# Altium schematic sheet IMX8_SOC.SchDoc
size 594 x 420 mm; SheetNumber: 3; SheetTotal: 12
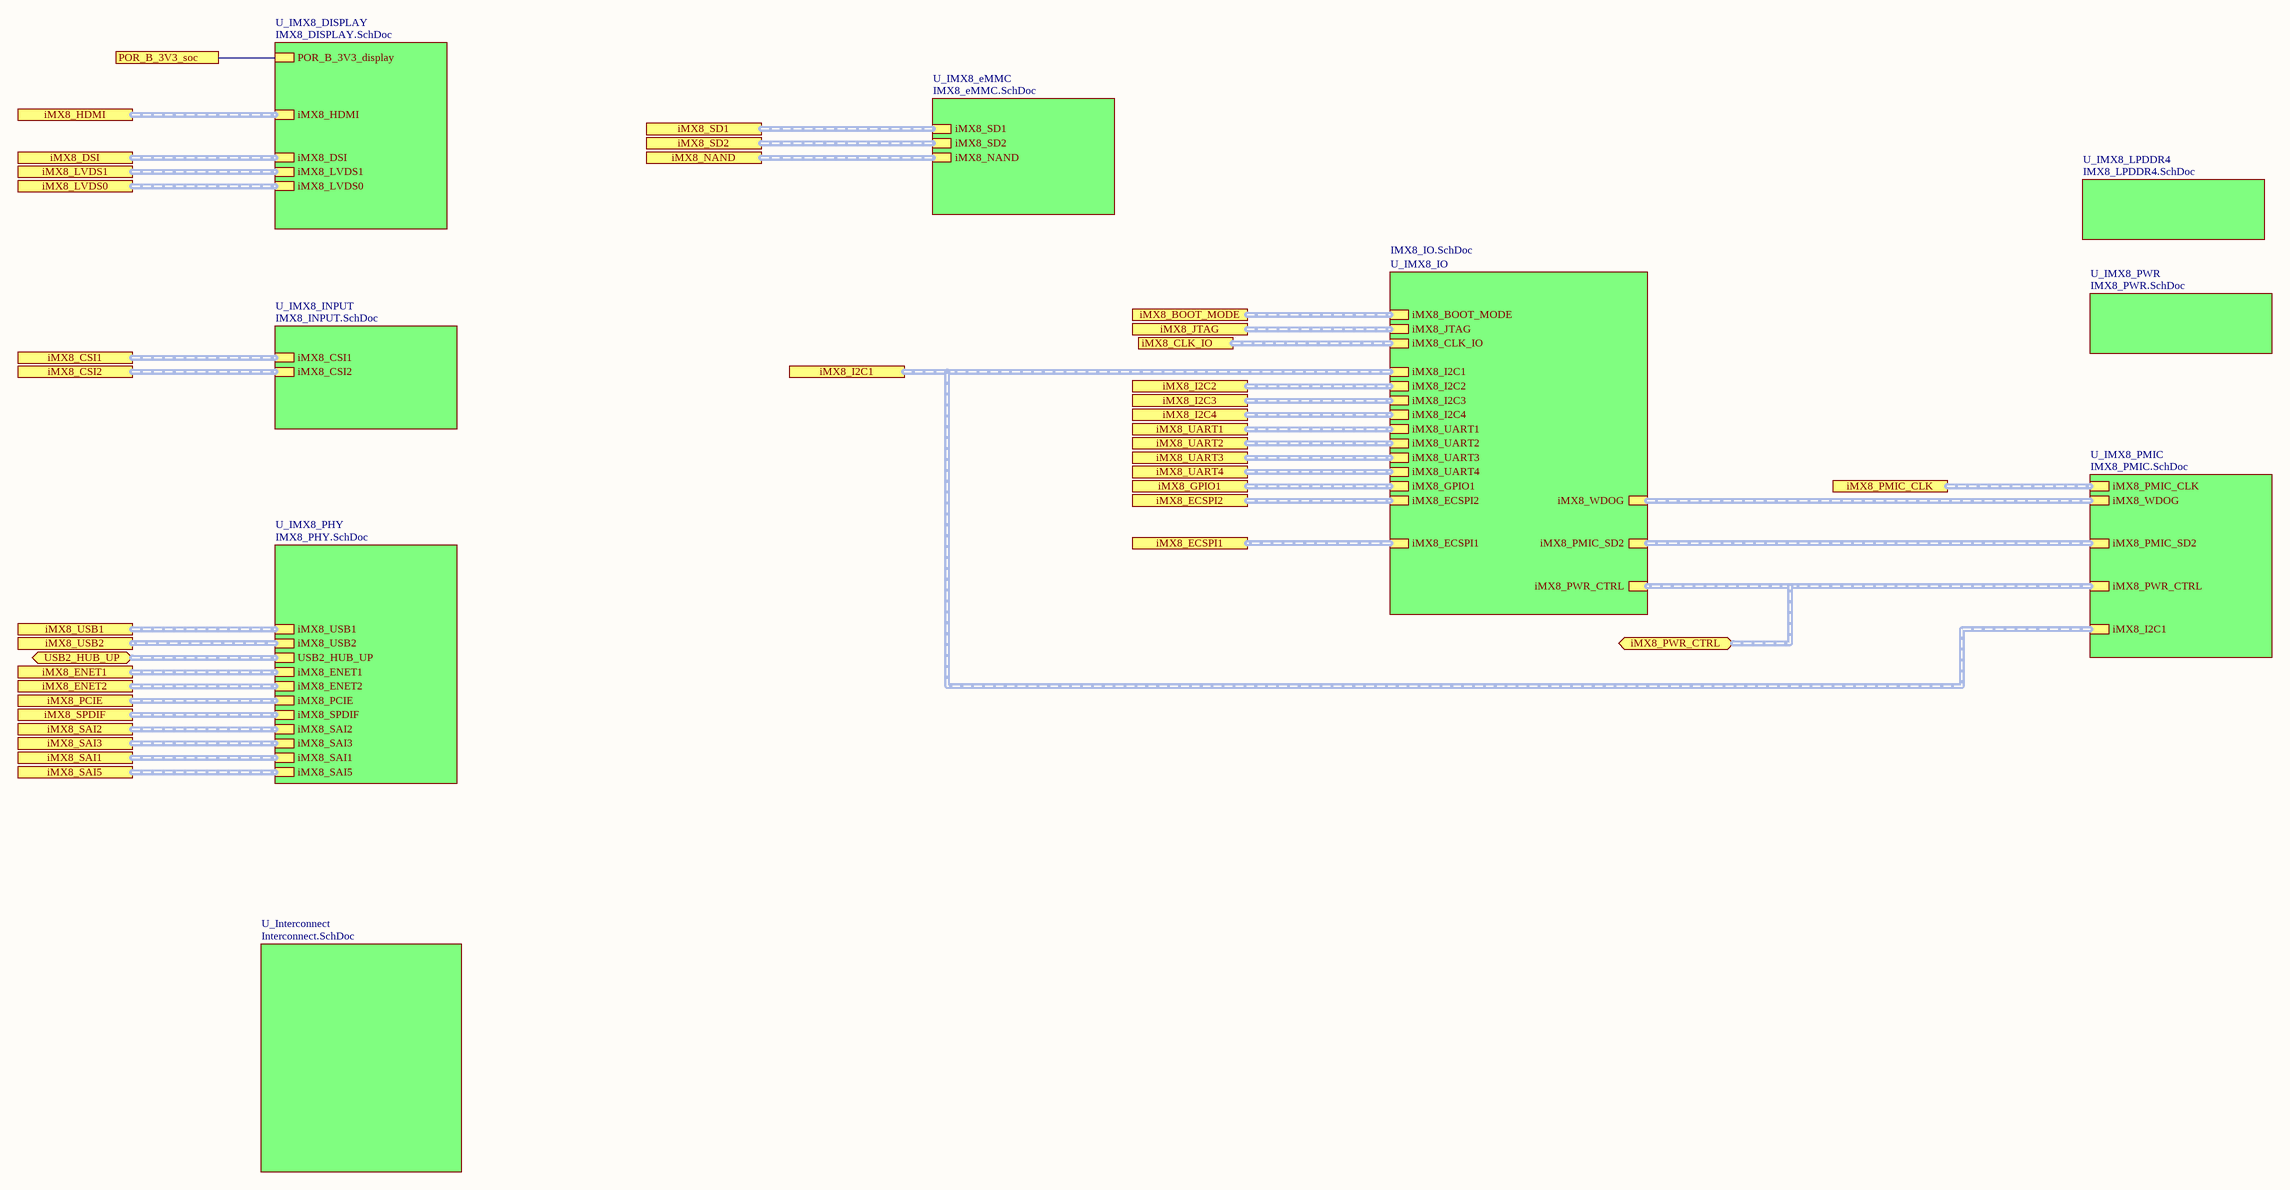
[diagram p0: IMX8_SOC.SchDoc]

## Sub-sheets
U_IMX8_DISPLAY = IMX8_DISPLAY.SchDoc: iMX8_LVDS0 (harness iMX8_LVDS0), iMX8_LVDS1 (harness iMX8_LVDS1), iMX8_DSI (harness iMX8_DSI), iMX8_HDMI (harness iMX8_HDMI), POR_B_3V3_display
U_IMX8_eMMC = IMX8_eMMC.SchDoc: iMX8_SD1 (harness iMX8_SD1), iMX8_SD2 (harness iMX8_SD2), iMX8_NAND (harness iMX8_NAND)
U_IMX8_INPUT = IMX8_INPUT.SchDoc: iMX8_CSI1 (harness iMX8_CSI1), iMX8_CSI2 (harness iMX8_CSI2)
U_IMX8_IO = IMX8_IO.SchDoc: iMX8_BOOT_MODE (harness iMX8_BOOT_MODE), iMX8_JTAG (harness iMX8_JTAG), iMX8_CLK_IO (harness iMX8_CLK_IO_sub), iMX8_PWR_CTRL (harness iMX8_PWR_CTRL), iMX8_I2C1 (harness iMX8_I2C1), iMX8_I2C2 (harness iMX8_I2C2), iMX8_I2C3 (harness iMX8_I2C3), iMX8_I2C4 (harness iMX8_I2C4), iMX8_UART1 (harness iMX8_UART1), iMX8_UART2 (harness iMX8_UART2), iMX8_UART3 (harness iMX8_UART3), iMX8_UART4 (harness iMX8_UART4), iMX8_GPIO1 (harness iMX8_GPIO1), iMX8_ECSPI2 (harness iMX8_ECSPI2), iMX8_WDOG (harness iMX8_WDOG), iMX8_PMIC_SD2 (harness iMX8_PMIC_SD2), iMX8_ECSPI1 (harness iMX8_ECSPI1)
U_IMX8_LPDDR4 = IMX8_LPDDR4.SchDoc: no entries
U_IMX8_PHY = IMX8_PHY.SchDoc: iMX8_USB1 (harness iMX8_USB1), iMX8_USB2 (harness iMX8_USB2), USB2_HUB_UP (harness USB2_HUB_UP), iMX8_ENET1 (harness iMX8_ENET1), iMX8_ENET2 (harness iMX8_ENET2), iMX8_PCIE (harness iMX8_PCIE), iMX8_SPDIF (harness iMX8_SPDIF), iMX8_SAI2 (harness iMX8_SAI2), iMX8_SAI3 (harness iMX8_SAI3), iMX8_SAI1 (harness iMX8_SAI1), iMX8_SAI5 (harness iMX8_SAI5)
U_IMX8_PMIC = IMX8_PMIC.SchDoc: iMX8_PMIC_CLK (harness iMX8_PMIC_CLK), iMX8_WDOG (harness iMX8_WDOG), iMX8_I2C1 (harness iMX8_I2C1), iMX8_PWR_CTRL (harness iMX8_PWR_CTRL), iMX8_PMIC_SD2 (harness iMX8_PMIC_SD2)
U_IMX8_PWR = IMX8_PWR.SchDoc: no entries
U_Interconnect = Interconnect.SchDoc: no entries

## Ports
iMX8_BOOT_MODE (harness iMX8_BOOT_MODE), iMX8_CLK_IO (harness iMX8_CLK_IO_sub), iMX8_CSI1 (harness iMX8_CSI1), iMX8_CSI2 (harness iMX8_CSI2), iMX8_DSI (harness iMX8_DSI), iMX8_ECSPI1 (harness iMX8_ECSPI1), iMX8_ECSPI2 (harness iMX8_ECSPI2), iMX8_ENET1, iMX8_ENET2 (harness iMX8_ENET), iMX8_GPIO1 (harness iMX8_GPIO1), iMX8_HDMI (harness iMX8_HDMI), iMX8_I2C1 (harness iMX8_I2C1), iMX8_I2C2 (harness iMX8_I2C2), iMX8_I2C3 (harness iMX8_I2C3), iMX8_I2C4 (harness iMX8_I2C4), iMX8_JTAG (harness iMX8_JTAG), iMX8_LVDS0 (harness iMX8_LVDS0), iMX8_LVDS1 (harness iMX8_LVDS1), iMX8_NAND (harness iMX8_PCIE), iMX8_PCIE (harness iMX8_PCIE), iMX8_PMIC_CLK (harness iMX8_PMIC_CLK), iMX8_PWR_CTRL (bidir, harness iMX8_PWR_CTRL), iMX8_SAI1 (harness iMX8_SAI1), iMX8_SAI2 (harness iMX8_SAI2), iMX8_SAI3 (harness iMX8_SAI3), iMX8_SAI5 (harness iMX8_SAI5), iMX8_SD1 (harness iMX8_SD1), iMX8_SD2 (harness iMX8_SD2), iMX8_SPDIF (harness iMX8_SPDIF), iMX8_UART1 (harness iMX8_UART1), iMX8_UART2 (harness iMX8_UART2), iMX8_UART3 (harness iMX8_UART3), iMX8_UART4 (harness iMX8_UART4), iMX8_USB1 (harness iMX8_USB1), iMX8_USB2 (harness iMX8_USB2), POR_B_3V3_soc, USB2_HUB_UP (bidir, harness USB2_HUB_UP)

## Nets
POR_B_3V3_soc: port POR_B_3V3_soc, sheet U_IMX8_DISPLAY/POR_B_3V3_display

## Buses and harness runs
harness port iMX8_BOOT_MODE = sheet U_IMX8_IO/iMX8_BOOT_MODE
harness port iMX8_CLK_IO = sheet U_IMX8_IO/iMX8_CLK_IO
harness port iMX8_CSI1 = sheet U_IMX8_INPUT/iMX8_CSI1
harness port iMX8_CSI2 = sheet U_IMX8_INPUT/iMX8_CSI2
harness port iMX8_DSI = sheet U_IMX8_DISPLAY/iMX8_DSI
harness port iMX8_ECSPI1 = sheet U_IMX8_IO/iMX8_ECSPI1
harness port iMX8_ECSPI2 = sheet U_IMX8_IO/iMX8_ECSPI2
harness port iMX8_ENET1 = sheet U_IMX8_PHY/iMX8_ENET1
harness port iMX8_ENET2 = sheet U_IMX8_PHY/iMX8_ENET2
harness port iMX8_GPIO1 = sheet U_IMX8_IO/iMX8_GPIO1
harness port iMX8_HDMI = sheet U_IMX8_DISPLAY/iMX8_HDMI
harness port iMX8_I2C1 = sheet U_IMX8_IO/iMX8_I2C1 = sheet U_IMX8_PMIC/iMX8_I2C1
harness port iMX8_I2C2 = sheet U_IMX8_IO/iMX8_I2C2
harness port iMX8_I2C3 = sheet U_IMX8_IO/iMX8_I2C3
harness port iMX8_I2C4 = sheet U_IMX8_IO/iMX8_I2C4
harness port iMX8_JTAG = sheet U_IMX8_IO/iMX8_JTAG
harness port iMX8_LVDS0 = sheet U_IMX8_DISPLAY/iMX8_LVDS0
harness port iMX8_LVDS1 = sheet U_IMX8_DISPLAY/iMX8_LVDS1
harness port iMX8_NAND = sheet U_IMX8_eMMC/iMX8_NAND
harness port iMX8_PCIE = sheet U_IMX8_PHY/iMX8_PCIE
harness port iMX8_PMIC_CLK = sheet U_IMX8_PMIC/iMX8_PMIC_CLK
harness port iMX8_PWR_CTRL = sheet U_IMX8_IO/iMX8_PWR_CTRL = sheet U_IMX8_PMIC/iMX8_PWR_CTRL
harness port iMX8_SAI1 = sheet U_IMX8_PHY/iMX8_SAI1
harness port iMX8_SAI2 = sheet U_IMX8_PHY/iMX8_SAI2
harness port iMX8_SAI3 = sheet U_IMX8_PHY/iMX8_SAI3
harness port iMX8_SAI5 = sheet U_IMX8_PHY/iMX8_SAI5
harness port iMX8_SD1 = sheet U_IMX8_eMMC/iMX8_SD1
harness port iMX8_SD2 = sheet U_IMX8_eMMC/iMX8_SD2
harness port iMX8_SPDIF = sheet U_IMX8_PHY/iMX8_SPDIF
harness port iMX8_UART1 = sheet U_IMX8_IO/iMX8_UART1
harness port iMX8_UART2 = sheet U_IMX8_IO/iMX8_UART2
harness port iMX8_UART3 = sheet U_IMX8_IO/iMX8_UART3
harness port iMX8_UART4 = sheet U_IMX8_IO/iMX8_UART4
harness port iMX8_USB1 = sheet U_IMX8_PHY/iMX8_USB1
harness port iMX8_USB2 = sheet U_IMX8_PHY/iMX8_USB2
harness port USB2_HUB_UP = sheet U_IMX8_PHY/USB2_HUB_UP
harness sheet U_IMX8_IO/iMX8_PMIC_SD2 = sheet U_IMX8_PMIC/iMX8_PMIC_SD2
harness sheet U_IMX8_IO/iMX8_WDOG = sheet U_IMX8_PMIC/iMX8_WDOG

## Notes on the sheet
- DWG NO:
- REV:
- THIS DOCUMENT AND THE DATA DISCLOSED HEREIN OR
- HEREWITH IS THE PROPERTY OF ALTIUM LIMITED AND MAY
- BE FREELY DISTRIBUTED IN WHOLE. NO RIGHTS ARE
- RESERVED OR EXPRESS OR IMPLIED WARANTEE GIVEN.
- REVISION
- DESCRIPTION
- DATE
- APPROVED
- ENG:
- APPROVALS
- PROJECT
- DSN:
- CHK:
- REFERENCE DOCUMENTS
- PROJECT REVISION:
- TITLE
- DOCUMENT REVISION:
- DESIGN ITEM:
- BOM:
- FAB DWG:
- PCB DWG:
- ASSY DWG:
- SCALE:
- A2
- SIZE
- CAGE CODE
- FILE NAME
- DWG NO.
- SHEET
- OF
- REV